# Altium schematic sheet Power_Supply.SchDoc
size A; SheetNumber: 4; SheetTotal: 4
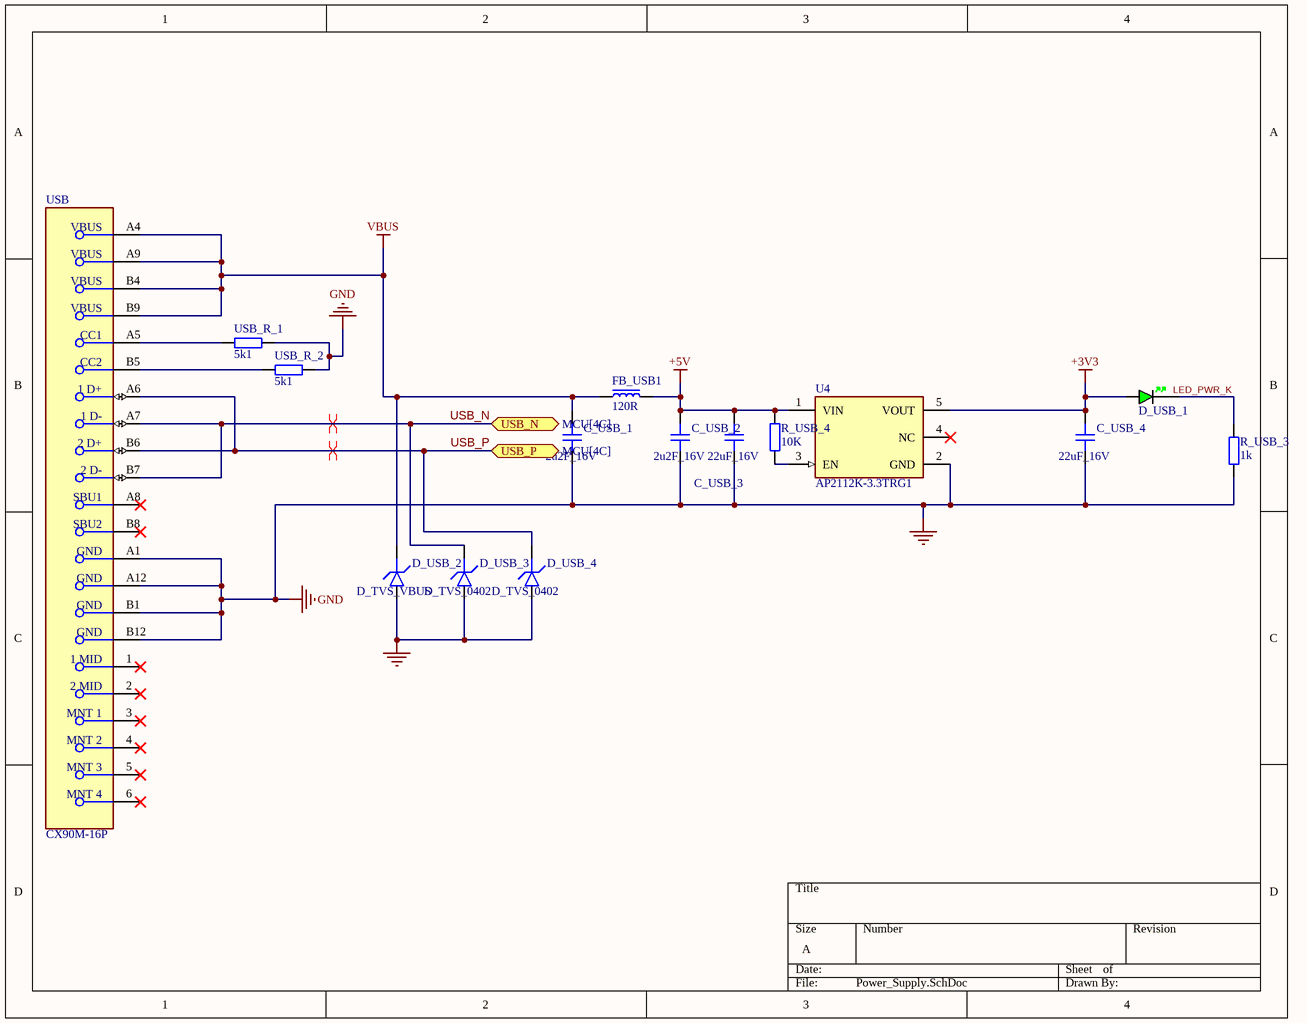
[diagram p0: Power_Supply.SchDoc]

## Parts
C_USB_1  2u2F_16V  [CAP_0603]
C_USB_2  2u2F_16V  [CAP_0603]
C_USB_3  22uF_16V  [CAP_0805]
C_USB_4  22uF_16V  [CAP_0805]
D_USB_1  GREEN  [LED_0402_GREEN]  (value not drawn)
D_USB_2  D_TVS_VBUS  [D_0402]
D_USB_3  D_TVS_0402  [D_0402]
D_USB_4  D_TVS_0402  [D_0402]
FB_USB1  120R  [FB_0603]
R_USB_3  1k  [RES_0402]
R_USB_4  10K  [RES_0402]
U4  AP2112K-3.3TRG1  [FP-SOT25-IPC_A]
USB  CX90M-16P  [FP-CX90M-16P-MFG]
USB_R_1  5k1  [RES_0402]
USB_R_2  5k1  [RES_0402]

## Ports
USB_N (bidir, see MCU[4C]), USB_P (bidir, see MCU[4C])

## Nets
+3V3: C_USB_4.2 D_USB_1.A U4.5(VOUT)
+5V: C_USB_2.2 C_USB_3.2 FB_USB1.2 R_USB_4.1 U4.1(VIN)
GND: C_USB_1.1 C_USB_2.1 C_USB_3.1 C_USB_4.1 D_USB_2.A D_USB_3.A D_USB_4.A R_USB_3.1 U4.2(GND) USB.A1(GND) USB.A12(GND) USB.B1(GND) USB.B12(GND) USB_R_1.2 USB_R_2.2
VBUS: C_USB_1.2 D_USB_2.K FB_USB1.1 USB.A4(VBUS) USB.A9(VBUS) USB.B4(VBUS) USB.B9(VBUS)
LED_PWR_K: D_USB_1.K R_USB_3.2
USB_N: D_USB_3.K USB.A7(1_D-) USB.B7(2_D-) ; port USB_N
USB_P: D_USB_4.K USB.A6(1_D+) USB.B6(2_D+) ; port USB_P
NetR_USB_4_2: R_USB_4.2 U4.3(EN)
NetUSB_A5: USB.A5(CC1) USB_R_1.1
NetUSB_B5: USB.B5(CC2) USB_R_2.1

Not connected (* = marked no-connect by the designer): U4 4(NC)*; USB 1(1_MID)* 2(2_MID)* 3(MNT_1)* 4(MNT_2)* 5(MNT_3)* 6(MNT_4)* A8(SBU1)* B8(SBU2)*

## Layout directives
differential pair; differential pair class USB_DIFF: USB_N, USB_P

## Library data of the parts
C_USB_1 C_USB_2 = CAP_0603: Capacitor SMD 0603; Manufacturer: *; Manufacturer Part Number: *; Distributor Link: *; LCSC: *; Rating: *; Dielectric: *
C_USB_3 C_USB_4 = CAP_0805: Capacitor SMD 0805; Manufacturer: *; Manufacturer Part Number: *; Distributor Link: *; LCSC: *; Rating: *; Dielectric: *
D_USB_1 = LED_0402_GREEN: LED 0402 GREEN SMD
D_USB_2-D_USB_4 = D_TVS_0402: Diode TVS / ESD 0402
FB_USB1 = FB_0603: Ferrite Bead SMD 0603; Manufacturer: *; Manufacturer Part Number: *; Distributor Link: *; LCSC: *
R_USB_3 R_USB_4 USB_R_1 USB_R_2 = RES_0402: Resistor SMD 0402; Manufacturer: *; Manufacturer Part Number: *; Distributor Link: *; LCSC: *
U4 = CMP-12756-000035-1: IC REG LINEAR 3.3V 600MA SOT25; Number of Regulators: 1; Output Type: Fixed; Polarity: Positive; Min Input Voltage: 2.5V; Max Input Voltage: 6V; Accuracy: 1.5%; Quiescent Current: 55uA; Dropout Voltage: 250mV; Min Operating Temperature: -40°C; Length: 3.1mm; Output Current: 600mA; Max Operating Temperature: 85°C; Package Quantity: 1; Output Voltage: 3.3V; Width: 1.7mm; Number of Outputs: 1; Packaging: Tape and Reel; Height: 1.3mm; Lead Free: Lead Free; Max Output Current: 600mA; Case/Package: SOT-23-5; Mount: Surface Mount; Number of Pins: 5
USB = CMP-11601-000005-1: CONN RCPT USB2.0 TYPEC 16POS SMD; Connector Type: USB; Current Rating: 1.25A; Mating Cycles: 10000; Number of Contacts: 16; Gender: Receptacle; Shielding: Shielded; Number of Ports: 1; Insulation Color: Black; Termination: Solder; Min Operating Temperature: -30°C; Flammability Rating: UL94 V-0; Max Operating Temperature: 85°C; Packaging: Cut Tape; Contact Plating: Gold; Mount: Surface Mount